# Altium schematic sheet 01_detection.SchDoc
size A3; SheetNumber: 2; SheetTotal: 17
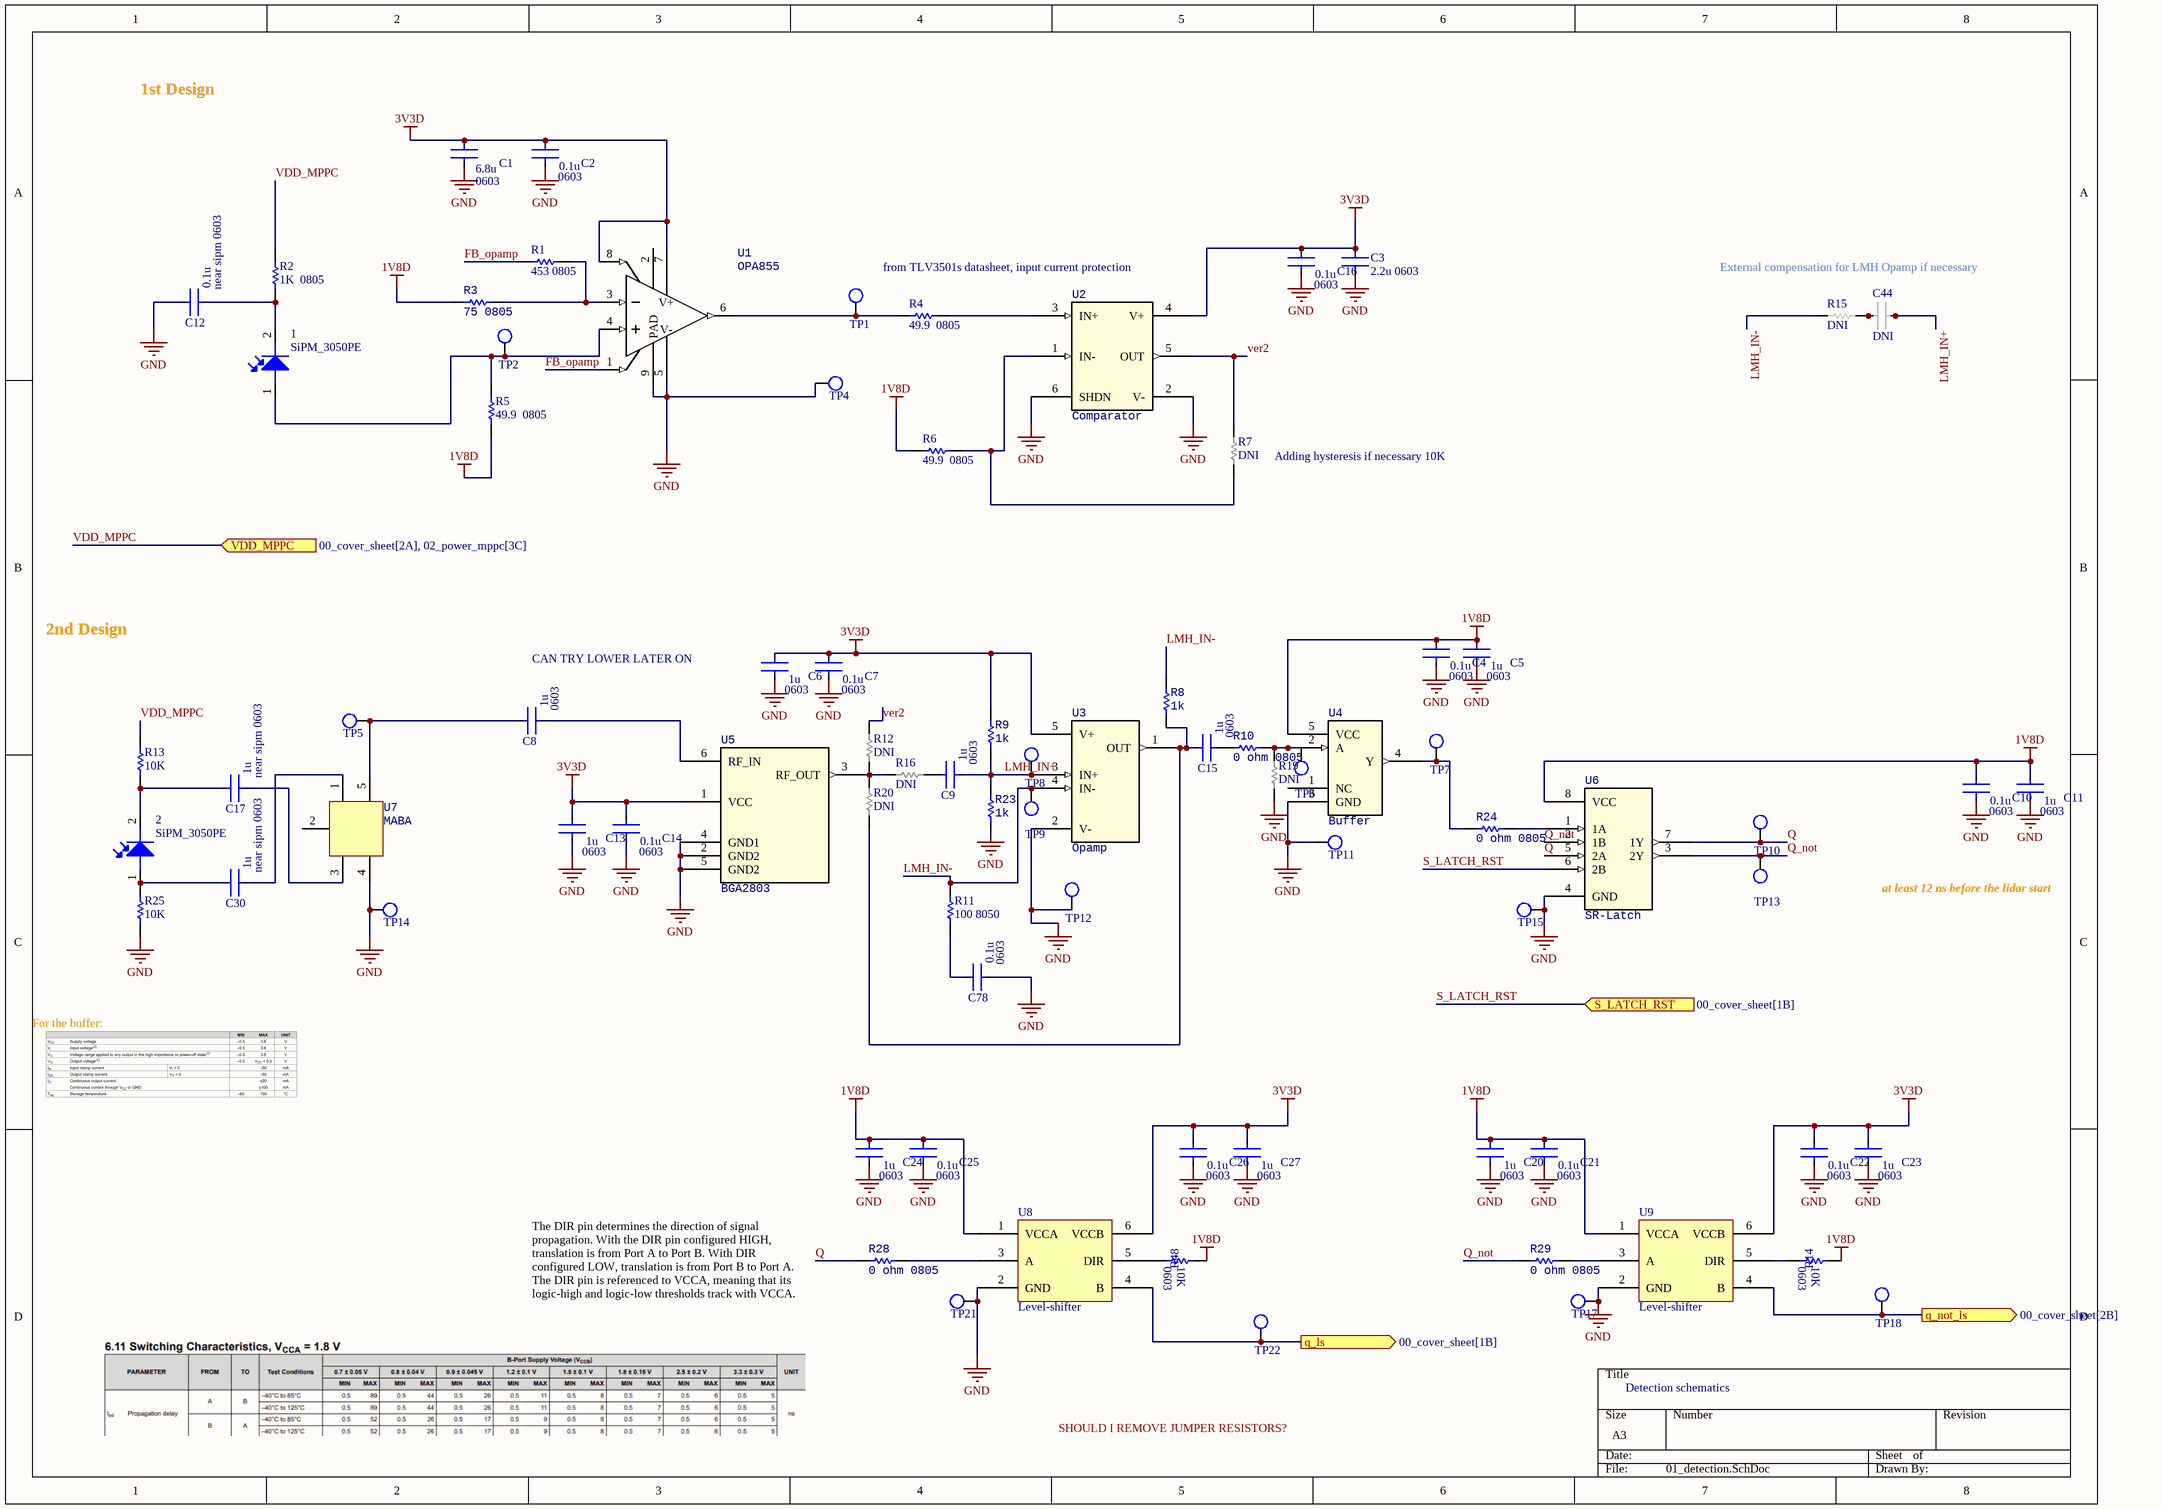
[diagram p0: 01_detection.SchDoc]

## Parts
1  SiPM_3050PE  [MPPC-S13360-3050PE]
2  SiPM_3050PE  [MPPC-S13360-3050PE]
C1  C1608X5R1E685K080AC  [CAPTDK0603]  (value not drawn)
C2  CGA3E2X7R1H104K080AA  [CAPTDK0603]  (value not drawn)
C3  2.2u 0603  [CAPTDK0603]
C4  CGA3E2X7R1H104K080AA  [CAPTDK0603]  (value not drawn)
C5  C1608X5R1E105K080AC  [CAPTDK0603]  (value not drawn)
C6  C1608X5R1E105K080AC  [CAPTDK0603]  (value not drawn)
C7  CGA3E2X7R1H104K080AA  [CAPTDK0603]  (value not drawn)
C8  C1608X5R1E105K080AC  [CAPTDK0603]  (value not drawn)
C9  C1608X5R1E105K080AC  [CAPTDK0603]  (value not drawn)
C10  CGA3E2X7R1H104K080AA  [CAPTDK0603]  (value not drawn)
C11  C1608X5R1E105K080AC  [CAPTDK0603]  (value not drawn)
C12  CL10B104KC8NNNC  [CAPTDK0603]  (value not drawn)
C13  C1608X5R1E105K080AC  [CAPTDK0603]  (value not drawn)
C14  CGA3E2X7R1H104K080AA  [CAPTDK0603]  (value not drawn)
C15  C1608X5R1E105K080AC  [CAPTDK0603]  (value not drawn)
C16  CGA3E2X7R1H104K080AA  [CAPTDK0603]  (value not drawn)
C17  GRM188D72A105KE01J  [CAPTDK0603]  (value not drawn)
C20  C1608X5R1E105K080AC  [CAPTDK0603]  (value not drawn)
C21  CGA3E2X7R1H104K080AA  [CAPTDK0603]  (value not drawn)
C22  CGA3E2X7R1H104K080AA  [CAPTDK0603]  (value not drawn)
C23  C1608X5R1E105K080AC  [CAPTDK0603]  (value not drawn)
C24  C1608X5R1E105K080AC  [CAPTDK0603]  (value not drawn)
C25  CGA3E2X7R1H104K080AA  [CAPTDK0603]  (value not drawn)
C26  CGA3E2X7R1H104K080AA  [CAPTDK0603]  (value not drawn)
C27  C1608X5R1E105K080AC  [CAPTDK0603]  (value not drawn)
C30  GRM188D72A105KE01J  [CAPTDK0603]  (value not drawn)
C44  DNI  [CAPTDK0603]  (no BOM)
C78  CGA3E2X7R1H104K080AA  [CAPTDK0603]  (value not drawn)
R1  453 0805  [RES-STACK-POLE-0805]
R2  1K  0805  [RES-STACK-POLE-0805]
R3  75 0805  [RES-STACK-POLE-0805]
R4  49.9  0805  [RES-STACK-POLE-0805]
R5  49.9  0805  [RES-STACK-POLE-0805]
R6  49.9  0805  [RES-STACK-POLE-0805]
R7  DNI  [RES-STACK-POLE-0805]
R8  1k  [RES_0603]
R9  1k  [RES_0603]
R10  0 ohm 0805  [RES-STACK-POLE-0805]
R11  100 8050  [RES-STACK-POLE-0805]
R12  DNI  [RES-STACK-POLE-0805]
R13  10K  [RES-STACK-POLE-0805]
R14  RMCF0603JG10K0  [RES-STACK-POLE-0603]  (value not drawn)
R15  DNI  [RES_0603]
R16  DNI  [RES-STACK-POLE-0805]
R19  DNI  [RES-STACK-POLE-0805]
R20  DNI  [RES-STACK-POLE-0805]
R23  1k  [RES_0603]
R24  0 ohm 0805  [RES-STACK-POLE-0805]
R25  10K  [RES-STACK-POLE-0805]
R28  0 ohm 0805  [RES-STACK-POLE-0805]
R29  0 ohm 0805  [RES-STACK-POLE-0805]
R48  RMCF0603JG10K0  [RES-STACK-POLE-0603]  (value not drawn)
TP1  TESTPOINT_S  [TESTPOINT_S]  (value not drawn)  (no BOM)
TP2  TESTPOINT_S  [TESTPOINT_S]  (value not drawn)  (no BOM)
TP4  TESTPOINT_S  [TESTPOINT_S]  (value not drawn)  (no BOM)
TP5  TESTPOINT_S  [TESTPOINT_S]  (value not drawn)  (no BOM)
TP6  TESTPOINT_S  [TESTPOINT_S]  (value not drawn)  (no BOM)
TP7  TESTPOINT_S  [TESTPOINT_S]  (value not drawn)  (no BOM)
TP8  TESTPOINT_S  [TESTPOINT_S]  (value not drawn)  (no BOM)
TP9  TESTPOINT_S  [TESTPOINT_S]  (value not drawn)  (no BOM)
TP10  TESTPOINT_S  [TESTPOINT_S]  (value not drawn)  (no BOM)
TP11  TESTPOINT_S  [TESTPOINT_S]  (value not drawn)  (no BOM)
TP12  TESTPOINT_S  [TESTPOINT_S]  (value not drawn)  (no BOM)
TP13  TESTPOINT_S  [TESTPOINT_S]  (value not drawn)  (no BOM)
TP14  TESTPOINT_S  [TESTPOINT_S]  (value not drawn)  (no BOM)
TP15  TESTPOINT_S  [TESTPOINT_S]  (value not drawn)  (no BOM)
TP17  TESTPOINT_S  [TESTPOINT_S]  (value not drawn)  (no BOM)
TP18  TESTPOINT_S  [TESTPOINT_S]  (value not drawn)  (no BOM)
TP21  TESTPOINT_S  [TESTPOINT_S]  (value not drawn)  (no BOM)
TP22  TESTPOINT_S  [TESTPOINT_S]  (value not drawn)  (no BOM)
U1  OPA855  [WSON-08]
U2  Comparator  [SOT-23]
U3  Opamp  [MF05A-L]
U4  Buffer  [DBV0005A]
U5  BGA2803  [SOT_02,115_NXP-M]
U6  SR-Latch  [DCU0008A]
U7  MABA  [MABA-007159-]
U8  Level-shifter  [SON50P100X60-6N]
U9  Level-shifter  [SON50P100X60-6N]

## Ports
q_ls (out, see 00_cover_sheet[1B]), q_not_ls (out, see 00_cover_sheet[2B]), S_LATCH_RST (in, see 00_cover_sheet[1B]), VDD_MPPC (in, see 00_cover_sheet[2A], 02_power_mppc[3C])

## Nets
1V8D: C4.1 C5.1 C10.1 C11.1 C20.1 C21.1 C24.1 C25.1 R3.1 R5.1 R6.1 R14.2 R48.2 U4.5(VCC) U6.8(VCC) U8.1(VCCA) U9.1(VCCA)
3V3D: C1.1 C2.1 C3.1 C6.1 C7.1 C13.1 C14.1 C16.1 C22.1 C23.1 C26.1 C27.1 R9.2 U1.7(VS+) U1.8(PD_N) U2.4(V+) U3.5(V+) U5.1(VCC) U8.6(VCCB) U9.6(VCCB)
GND: C1.2 C2.2 C3.2 C4.2 C5.2 C6.2 C7.2 C10.2 C11.2 C12.1 C13.2 C14.2 C16.2 C20.2 C21.2 C22.2 C23.2 C24.2 C25.2 C26.2 C27.2 C78.2 R19.1 R23.1 R25.1 TP4.1 TP11.1 TP12.1 TP14.1 TP15.1 TP17.1 TP21.1 U1.5(VS-) U1.9(PAD) U2.2(V-) U2.6(SHDN) U3.2(V-) U4.3(GND) U5.2(GND2) U5.4(GND1) U5.5(GND2) U6.4(GND) U7.4 U8.2(GND) U9.2(GND)
FB_opamp: R1.1 U1.1(FB)
LMH_IN+: C9.2 C44.2 R9.1 R23.2 TP8.1 U3.3(IN+)
LMH_IN-: R8.2 R11.2 R15.1 TP9.1 U3.4(IN-)
Q: R28.1 TP10.1 U6.5(2A) U6.7(1Y)
q_ls: TP22.1 U8.4(B) ; port q_ls
Q_not: R29.1 TP13.1 U6.2(1B) U6.3(2Y)
q_not_ls: TP18.1 U9.4(B) ; port q_not_ls
S_LATCH_RST: U6.6(2B) ; port S_LATCH_RST
VDD_MPPC: R2.2 R13.2 ; port VDD_MPPC
ver2: R7.2 R12.2 U2.5(OUT)
Net1_1: 1.1 R5.2 TP2.1 U1.4(IN+)
Net1_2: 1.2 C12.2 R2.1
Net2_1: 2.1 C30.1 R25.2
Net2_2: 2.2 C17.1 R13.1
NetC8_1: C8.1 TP5.1 U7.5
NetC8_2: C8.2 U5.6(RF_IN)
NetC9_1: C9.1 R16.2
NetC15_1: C15.1 R8.1 R20.1 U3.1(OUT)
NetC15_2: C15.2 R10.1
NetC17_2: C17.2 U7.3
NetC30_2: C30.2 U7.1
NetC44_1: C44.1 R15.2
NetC78_1: C78.1 R11.1
NetR1_2: R1.2 R3.2 U1.3(IN-)
NetR4_1: R4.1 TP1.1 U1.6(OUT)
NetR4_2: R4.2 U2.3(IN+)
NetR6_2: R6.2 R7.1 U2.1(IN-)
NetR10_2: R10.2 R19.2 TP6.1 U4.2(A)
NetR12_1: R12.1 R16.1 R20.2 U5.3(RF_OUT)
NetR14_1: R14.1 U9.5(DIR)
NetR24_1: R24.1 TP7.1 U4.4(Y)
NetR24_2: R24.2 U6.1(1A)
NetR28_2: R28.2 U8.3(A)
NetR29_2: R29.2 U9.3(A)
NetR48_1: R48.1 U8.5(DIR)

Not connected (* = marked no-connect by the designer): U1 2(NC); U4 1(NC); U7 2

## Notes on the sheet
- 1st Design
- from TLV3501s datasheet, input current protection
- External compensation for LMH Opamp if necessary
- (near R7) Adding hysteresis if necessary 10K
- 2nd Design
- CAN TRY LOWER LATER ON
- at least 12 ns before the lidar start
- For the buffer:
- The DIR pin determines the direction of signal
  propagation. With the DIR pin configured HIGH,
  translation is from Port A to Port B. With DIR
  configured LOW, translation is from Port B to Port A.
  The DIR pin is referenced to VCCA, meaning that its
  logic-high and logic-low thresholds track with VCCA.
- Detection schematics
- SHOULD I REMOVE JUMPER RESISTORS?
- (in symbol C1608X5R1E105K080AC) 1u; 0603
- (in symbol C1608X5R1E685K080AC) 6.8u; 0603
- (in symbol CGA3E2X7R1H104K080AA) 0.1u; 0603
- (in symbol CL10B104KC8NNNC) 0.1u; near sipm 0603
- (in symbol GRM188D72A105KE01J) 1u; near sipm 0603
- (in symbol OPA855) V+; V-
- (in symbol RMCF0603JG10K0) 0603; 10K

## Library data of the parts
C1 = C1608X5R1E685K080AC: CAP CER 6.8UF 25V X5R 0603; Supplier 1: Digikey; Supplier Part Number 1: 445-14145-1-ND
C2 C4 C7 C10 C14 C16 C21 C22 C25 C26 C78 = CGA3E2X7R1H104K080AA: CAP CER 0.1UF 50V X7R 0603; Supplier 1: Digi-Key; Supplier Part Number 1: 445-5666-1-ND
C3 = C1608X5R1E225K080AB: CAP CER 2.2UF 25V X5R 0603; Supplier 1: Digikey; Supplier Part Number 1: 445-5964-1-ND
C5 C6 C8 C9 C11 C13 C15 C20 C23 C24 C27 = C1608X5R1E105K080AC: CAP CER 1UF 25V X5R 0603; Supplier 1: Digi-Key; Supplier Part Number 1: 445-5146-1-ND
C12 = CL10B104KC8NNNC: CAP CER 0.1UF 100V X7R 0603; Supplier 1: Digikey; Supplier Part Number 1: 1276-6807-1-ND
C17 C30 = GRM188D72A105KE01J: CAP CER 1UF 100V X7T 0603; Supplier 1: Digikey; Supplier Part Number 1: 490-GRM188D72A105KE01JCT-ND
C44 = C0402_PROVISION: CAP PROVISION 0603; Value: DNI
R1 = RK73H2ATTD4530F: RES 453 OHM 1% 1/4W 0805; Supplier 1: Digikey; Supplier Part Number 1: 2019-RK73H2ATTD4530FCT-ND
R2 = RK73H2ATTD1001F: RES 1K OHM 1% 1/4W 0805; Supplier 1: Digikey; Supplier Part Number 1: 2019-RK73H2ATTD1001FCT-ND
R3 = RK73H2ATTD75R0F: RES 75 OHM 1% 1/4W 0805; Supplier 1: Digikey; Supplier Part Number 1: 2019-RK73H2ATTD75R0FCT-ND
R4-R6 = RK73H2ATTD49R9F: RES 49.9 OHM 1% 1/4W 0805; Supplier 1: Digikey; Supplier Part Number 1: 2019-RK73H2ATTD49R9FCT-ND
R7 R12 R16 R19 R20 = R0805: RES DNI 0805
R8 R9 R23 = RMCF0603FT1K00: RES 1K OHM 1% 1/10W 0603; Manufacturer: Stackpole Electronics; Resistance: 1kR; Power Rating: 100mW; Temperature Coefficient: 100ppm/°C; Supplier 1: Digi-Key; Manufacturer Part Number: RMCF0603FT1K00; RoHS: Yes; Category: Chip SMD Resistors; Stock 1: 5784598; Pricing 1: 5000=0.00218 (USD); Mount: Surface Mount; Case/Package: 0603; Case Code (Metric): 1608; Case Code (Imperial): 0603; Contact Plating: Tin,Matte; Size Code: 0603; Min Operating Temperature: -55°C; Max Operating Temperature: 155°C; Packaging: Tape and Reel; Tolerance: 1%; Series: RMCF; Resistor Type: Thick Film; Number of Terminations: 2; Max Power Dissipation: 100mW; Features: Automotive AEC-Q200; Construction: Rectangular; Length: 1.55mm; Width: 0.031inch; Height: 0.022inch; Depth: 0.8mm; Radiation Hardening: No; Military Standard: Not; Lead Free: Lead Free; RoHS Compliant: Yes; ComponentLink1URL: https://www.seielect.com/catalog/sei-rmcf_rmcp.pdf?src-supplier=Digi-Key; ComponentLink1Description: https://www.seielect.com/catalog/sei-rmcf_rmcp.pdf?src-supplier=Digi-Key; ComponentLink2URL: https://www.seielect.com/catalog/SEI-RMCF_RMCP.pdf?src-supplier=Avnet; ComponentLink2Description: https://www.seielect.com/catalog/SEI-RMCF_RMCP.pdf?src-supplier=Avnet; ComponentLink3URL: https://www.seielect.com/catalog/SEI-Packaging.pdf?src-supplier=Avnet; ComponentLink3Description: https://www.seielect.com/catalog/SEI-Packaging.pdf?src-supplier=Avnet; ComponentLink4URL: https://www.seielect.com/catalog/SEI-Packaging.pdf?src-supplier=Arrow+Electronics; ComponentLink4Description: https://www.seielect.com/catalog/SEI-Packaging.pdf?src-supplier=Arrow+Electronics; ComponentLink5URL: https://www.seielect.com/catalog/SEI-RMCF_RMCP.pdf?src-supplier=Avnet+Asia; ComponentLink5Description: https://www.seielect.com/catalog/SEI-RMCF_RMCP.pdf?src-supplier=Avnet+Asia; ComponentLink6URL: http://www.seielect.com/Catalog/SEI-rmc.pdf?src-supplier=Future+Electronics; ComponentLink6Description: http://www.seielect.com/Catalog/SEI-rmc.pdf?src-supplier=Future+Electronics; ComponentLink7URL: https://www.seielect.com/catalog/SEI-Packaging.pdf?src-supplier=Verical; ComponentLink7Description: https://www.seielect.com/catalog/SEI-Packaging.pdf?src-supplier=Verical; ComponentLink8URL: https://www.seielect.com/catalog/SEI-Packaging.pdf?src-supplier=Quest; ComponentLink8Description: https://www.seielect.com/catalog/SEI-Packaging.pdf?src-supplier=Quest; Supplier Part Number 1: RMCF0603FT1K00TR-ND
R10 R24 R28 R29 = RC0805JR-070RL: RES 0 OHM JUMPER 1/8W 0805; Supplier 1: Digikey; Supplier Part Number 1: 311-0.0ARCT-ND
R11 = RK73H2AT1000F: RK73H2ATK001KIT %1 tolerance 100 ohm resistor 8050 package
R13 R25 = RK73H2ATTD1002F: RES 10K OHM 1% 1/4W 0805; Supplier 1: Digikey; Supplier Part Number 1: 2019-RK73H2ATTD1002FCT-ND
R14 R48 = RMCF0603JG10K0: RES 10K OHM 5% 1/10W 0603; Supplier 1: Digi-Key; Supplier Part Number 1: 738-RMCF0603JG10K0CT-ND
R15 = R0603: RES DNI 0603
TP1 TP2 TP4-TP15 TP17 TP18 TP21 TP22 = TESTPOINT_S: Testpoint Surface Pad
U1 = OPA855: IC OPAMP GP 1 CIRCUIT 8WSON; Supplier 1: Digikey; Supplier Part Number 1: 296-53158-1-ND
U2 = TLV35011AIDBVT: IC COMPARATOR 1 GEN PUR SOT23-6; Supplier 1: Digikey; Supplier Part Number 1: 296-18248-1-ND
U3 = LMH6629MFE/NOPB: IC OPAMP VFB 1 CIRCUIT SOT23-5; Supplier 1: Digikey; Supplier Part Number 1: LMH6629MFE/NOPBCT-ND
U4 = SN74AUC1G17DBVR: IC BUF NON-INVERT 2.7V SOT23-5; Supplier 1: Digikey; Supplier Part Number 1: 296-12654-1-ND
U5 = BGA2803: IC RF AMP GPS 0HZ-2.2GHZ 6TSSOP; Supplier 1: Digikey; Supplier Part Number 1: 568-8483-1-ND
U6 = SN74AUC2G02DCUR: 2-ch, 2-input, 0.8-V to 2.7-V high speed NOR gates; Supplier 1: Digikey; Supplier Part Number 1: 296-18570-1-ND
U7 = MABA-007159: BALUN 4.5MHZ-3GHZ 1:1 6SMD FLAT; Supplier 1: Digikey; Supplier Part Number 1: 1465-1302-1-ND
U8 U9 = SN74AXCH1T45DRY2: IC TRANSLTR BIDIRECTIONAL 6SON SN74AXCH1T45DRY2 texas instruments; Supplier 1: Digikey; Supplier Part Number 1: 296-SN74AXCH1T45DRY2CT-ND